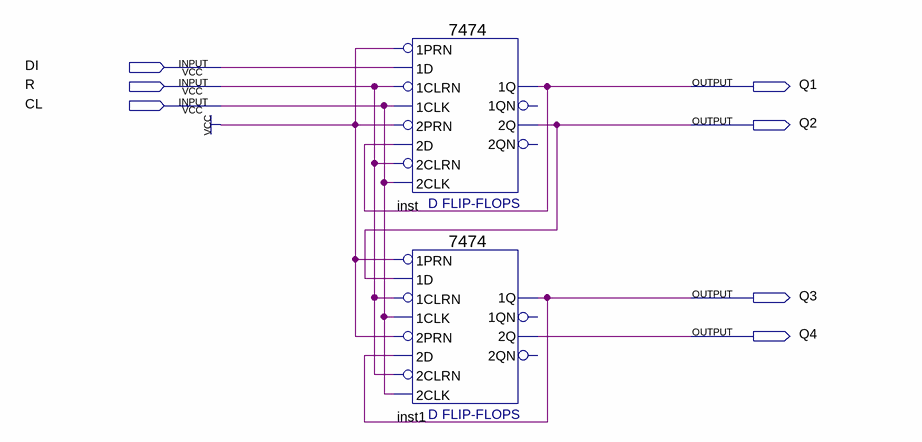
[diagram p0: schematic sheet]
// Quartus schematic lab1.bdf as structural Verilog: 2 symbols, 7 pins
module lab1 (
  input  DI,
  input  R,
  input  CL,
  output Q1,
  output Q2,
  output Q3,
  output Q4
);

  \7474  inst (
    .\2D (Q1), .\2PRN (1'b1), .\1CLK (CL), .\1D (DI), .\1PRN (1'b1), .\2CLK (CL), .\2CLRN (R), .\1CLRN (R),
    .\2Q (Q2), .\1Q (Q1));  // open: 1QN, 2QN
  \7474  inst1 (
    .\2D (Q3), .\2PRN (1'b1), .\1CLK (CL), .\1D (Q2), .\1PRN (1'b1), .\2CLK (CL), .\2CLRN (R), .\1CLRN (R),
    .\2Q (Q4), .\1Q (Q3));  // open: 1QN, 2QN
endmodule
